# EAGLE schematic amplifier (EAGLE 7.1.0)
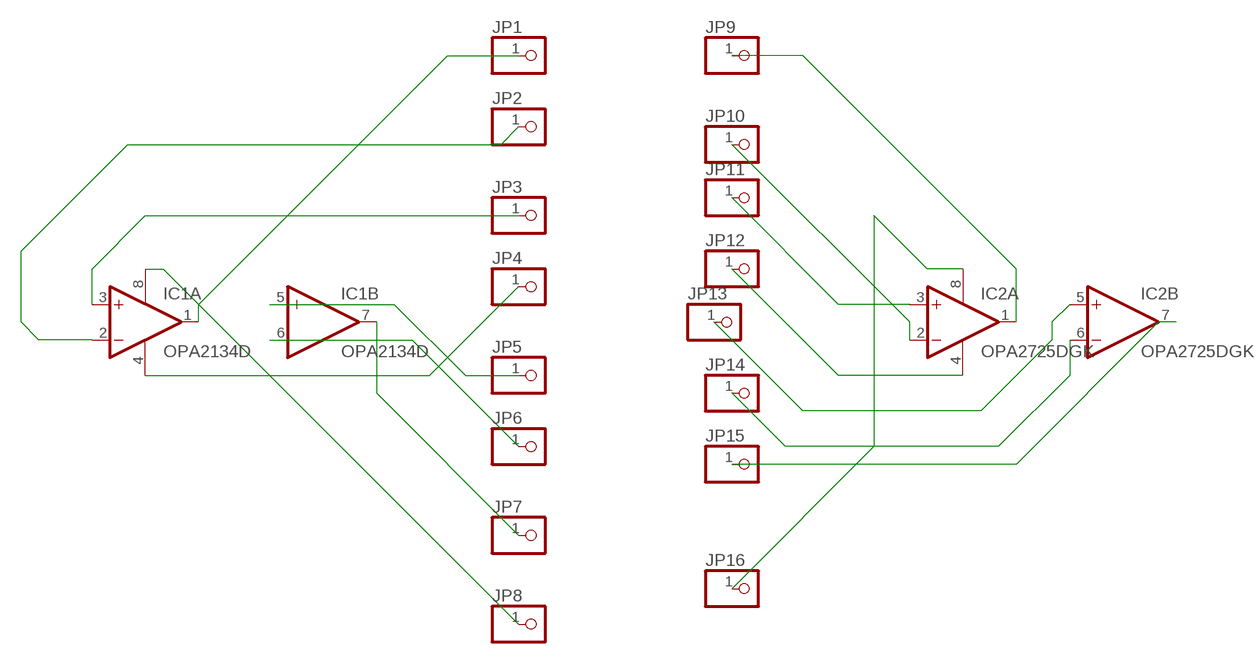
[diagram p0: schematic, sheet 1]

## Parts
IC1  OPA2134D  [SOIC8]
IC2  OPA2725DGK  [MSOP08]
JP1  PINHD-1X1  [1X01]
JP2  PINHD-1X1  [1X01]
JP3  PINHD-1X1  [1X01]
JP4  PINHD-1X1  [1X01]
JP5  PINHD-1X1  [1X01]
JP6  PINHD-1X1  [1X01]
JP7  PINHD-1X1  [1X01]
JP8  PINHD-1X1  [1X01]
JP9  PINHD-1X1  [1X01]
JP10  PINHD-1X1  [1X01]
JP11  PINHD-1X1  [1X01]
JP12  PINHD-1X1  [1X01]
JP13  PINHD-1X1  [1X01]
JP14  PINHD-1X1  [1X01]
JP15  PINHD-1X1  [1X01]
JP16  PINHD-1X1  [1X01]

## Nets
N$1: IC1.1(A:OUT) JP1.1
N$2: IC1.2(A:-IN) JP2.1
N$3: IC1.3(A:+IN) JP3.1
N$4: IC1.4(P:V-) JP4.1
N$5: IC1.5(B:+IN) JP5.1
N$6: IC1.6(B:-IN) JP6.1
N$7: IC1.7(B:OUT) JP7.1
N$8: IC1.8(P:V+) JP8.1
N$9: IC2.1(A:OUT) JP9.1
N$10: IC2.2(A:-IN) JP10.1
N$11: IC2.3(A:+IN) JP11.1
N$12: IC2.4(P:V-) JP12.1
N$13: IC2.5(B:+IN) JP13.1
N$14: IC2.6(B:-IN) JP14.1
N$15: IC2.7(B:OUT) JP15.1
N$16: IC2.8(P:V+) JP16.1

## Library data of the parts
IC1 = linear:OPA2134: SoundPLUS (TM) High Performance AUDIO OPERATIONAL AMPLIFIERS Source: http://focus.ti.com/lit/ds/sbos058/sbos058.pdf
IC2 = linear:OPA2725: Very Low Noise, High-Speed, 12V CMOS Operational Amplifier Source: http://focus.ti.com/lit/ds/symlink/opa725.pdf
JP1-JP16 = pinhead:PINHD-1X1: PIN HEADER